# Altium schematic sheet 2.POWER.SchDoc: MC-IMX6UL-CORE
size A4; DrawnBy: DrawnBy; DocumentNumber: MC-IMX6UL-CORE; Revision: V1.1; SheetNumber: 2 of 9
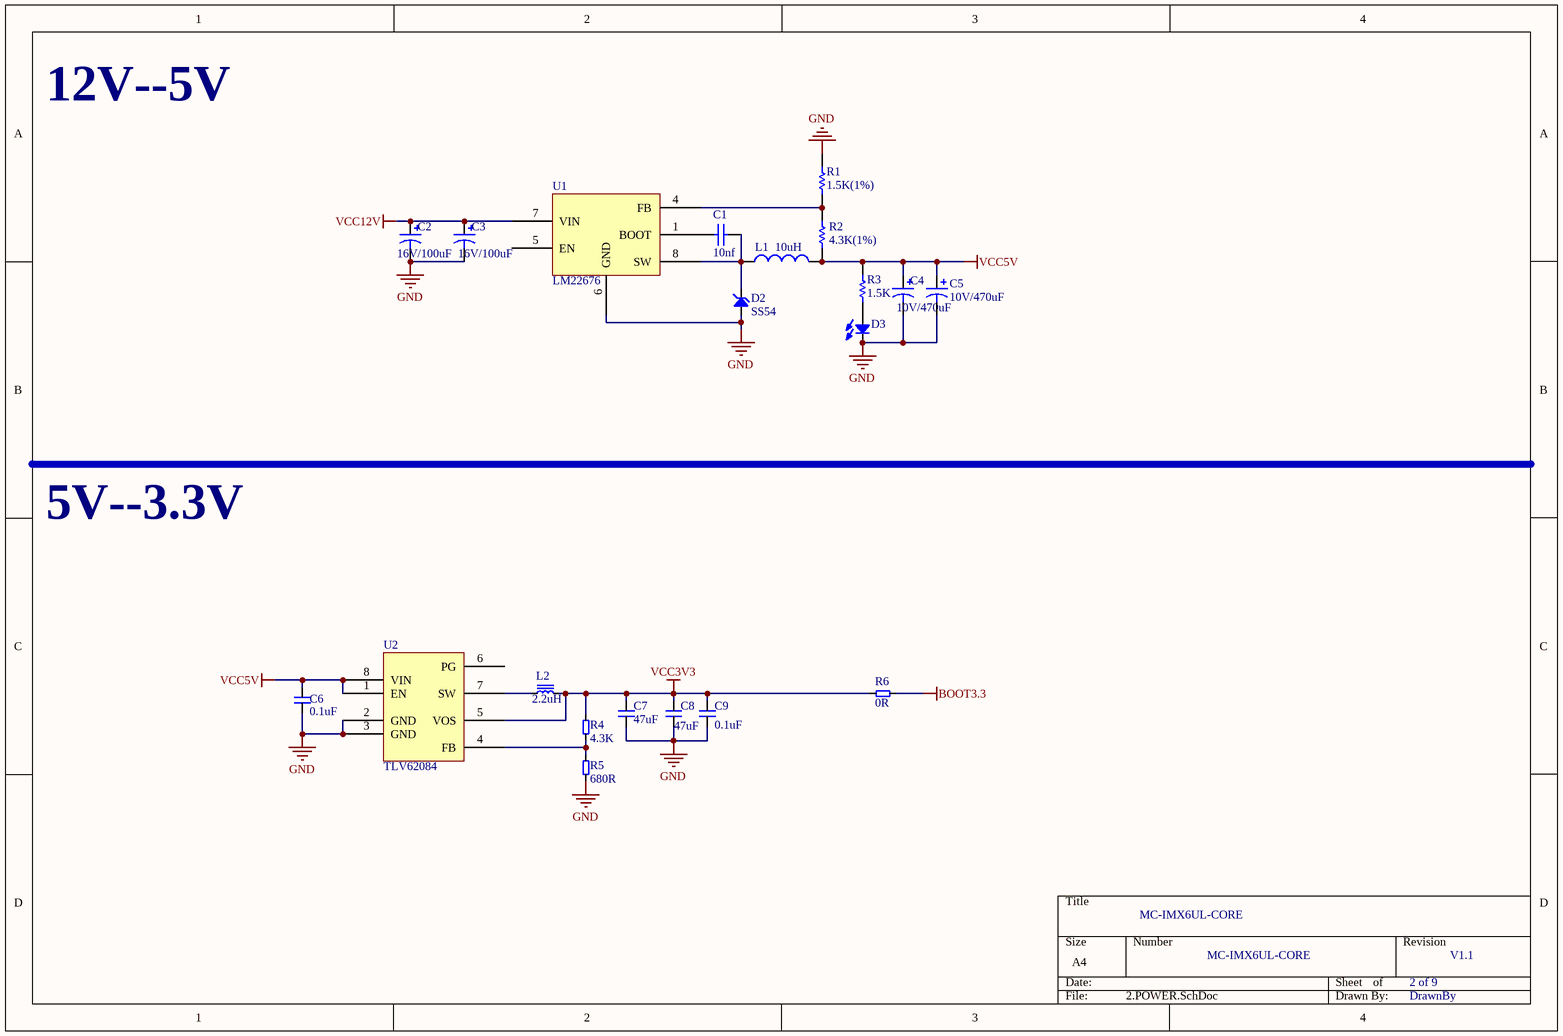
[diagram p0: 2.POWER.SchDoc]

## Parts
C1  value 10nf  [0603C]  (hidden comment: Cap)
C2  value 16V/100uF  [C7343]  (hidden comment: Cap Pol3)
C3  value 16V/100uF  [C7343]  (hidden comment: Cap Pol3)
C4  value 10V/470uF  [C7343]  (hidden comment: Cap Pol3)
C5  value 10V/470uF  [C7343]  (hidden comment: Cap Pol3)
C6  0.1uF  [0603C]
C7  47uF  [C1206]
C8  47uF  [C1206]
C9  0.1uF  [0603C]
D2  SS54  [SMA]
D3  发光二极管  [0603D]  (value not drawn)
L1  value 10uH  [L-8040]  (hidden comment: Inductor)
L2  2.2uH  [SDRH0420]
R1  value 1.5K(1%)  [0603R]  (hidden comment: Res1)
R2  value 4.3K(1%)  [0603R]  (hidden comment: Res1)
R3  value 1.5K  [0603R]  (hidden comment: Res1)
R4  4.3K  [0603R]
R5  680R  [0603R]
R6  0R  [0603R]
U1  LM22676  [SOP8-POW]
U2  TLV62084  [WSON8]

## Nets
BOOT3.3: R6.2
GND: C2.2 C3.2 C4.2 C5.2 C6.2 C7.2 C8.2 C9.2 D2.A D3.K R1.1 R5.1 U1.6(GND) U2.2(GND) U2.3(GND)
VCC3V3: C7.1 C8.1 C9.1 L2.2 R4.2 R6.1 U2.5(VOS)
VCC5V: C4.1 C5.1 C6.1 L1.2 R2.1 R3.1 U2.1(EN) U2.8(VIN)
VCC12V: C2.1 C3.1 U1.7(VIN)
NetC1_1: C1.1 D2.K L1.1 U1.8(SW)
NetC1_2: C1.2 U1.1(BOOT)
NetD3_A: D3.A R3.2
NetL2_1: L2.1 U2.7(SW)
NetR1_2: R1.2 R2.2 U1.4(FB)
NetR4_1: R4.1 R5.2 U2.4(FB)

Not connected (* = marked no-connect by the designer): U1 2(NC) 3(NC) 5(EN); U2 6(PG)

## Notes on the sheet
- 12V--5V
- 5V--3.3V

## Library data of the parts
C1 = Cap: Capacitor; Published: 8-Jun-2000; LatestRevisionDate: 17-Jul-2002; LatestRevisionNote: Re-released for DXP Platform.; PackageReference: RAD-0.3; Publisher: Altium Limited
C2-C5 = Cap Pol3: Polarized Capacitor (Surface Mount); Published: 8-Jun-2000; LatestRevisionDate: 17-Jul-2002; LatestRevisionNote: Re-released for DXP Platform.; PackageReference: C0805; Publisher: Altium Limited
C6-C9 = 电容
D2 = SS24: DIODES: *
L1 = Inductor: Code_IEC: 1005; Published: 8-Jun-2000; LatestRevisionDate: 17-Jul-2002; LatestRevisionNote: Re-released for DXP Platform.; PackageReference: 0402-A; Publisher: Altium Limited; Code_JEITA: 0402
L2 = 功率电感
R1-R3 = Res1: Resistor; Published: 8-Jun-2000; LatestRevisionDate: 17-Jul-2002; LatestRevisionNote: Re-released for DXP Platform.; PackageReference: AXIAL-0.3; Publisher: Altium Limited
R4-R6 = 电阻
U1 = LM22676-5.0